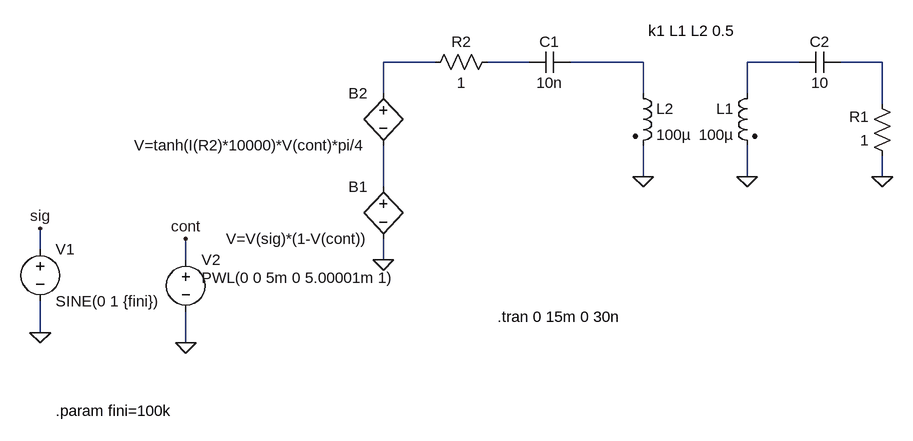
[diagram p0: schematic SS_PTS_v3.asc]
SS_PTS_v3.asc, the LTspice schematic file:
Version 4
SHEET 1 1432 680
WIRE -80 -352 -160 -352
WIRE 64 -352 0 -352
WIRE 240 -352 128 -352
WIRE 480 -352 400 -352
WIRE 608 -352 544 -352
WIRE -160 -304 -160 -352
WIRE 240 -304 240 -352
WIRE 400 -304 400 -352
WIRE 608 -288 608 -352
WIRE 240 -176 240 -224
WIRE 400 -176 400 -224
WIRE 608 -176 608 -208
WIRE -160 -160 -160 -224
WIRE -688 -64 -688 -96
WIRE -464 -48 -464 -80
WIRE -160 -48 -160 -80
WIRE -688 64 -688 16
WIRE -464 80 -464 32
FLAG -688 64 0
FLAG -464 80 0
FLAG -464 -80 cont
FLAG -688 -96 sig
FLAG -160 -48 0
FLAG 400 -176 0
FLAG 608 -176 0
FLAG 240 -176 0
SYMBOL voltage -688 -80 R0
WINDOW 123 0 0 Left 0
WINDOW 39 0 0 Left 0
SYMATTR InstName V1
SYMATTR Value SINE(0 1 {fini})
SYMBOL voltage -464 -64 R0
WINDOW 123 0 0 Left 0
WINDOW 39 0 0 Left 0
WINDOW 3 24 44 Left 2
SYMATTR Value PWL(0 0 5m 0 5.00001m 1)
SYMATTR InstName V2
SYMBOL bv -160 -176 M0
SYMATTR InstName B1
SYMATTR Value V=V(sig)*(1-V(cont))
SYMBOL bv -160 -320 M0
SYMATTR InstName B2
SYMATTR Value V=tanh(I(R2)*10000)*V(cont)*pi/4
SYMBOL ind2 416 -320 M0
SYMATTR InstName L1
SYMATTR Value 100µ
SYMATTR Type ind
SYMBOL cap 128 -368 R90
WINDOW 0 0 32 VBottom 2
WINDOW 3 32 32 VTop 2
SYMATTR InstName C1
SYMATTR Value 10n
SYMBOL res 624 -192 R180
WINDOW 0 36 76 Left 2
WINDOW 3 36 40 Left 2
SYMATTR InstName R1
SYMATTR Value 1
SYMBOL cap 544 -368 R90
WINDOW 0 0 32 VBottom 2
WINDOW 3 32 32 VTop 2
SYMATTR InstName C2
SYMATTR Value 10
SYMBOL res -96 -336 R270
WINDOW 0 32 56 VTop 2
WINDOW 3 0 56 VBottom 2
SYMATTR InstName R2
SYMATTR Value 1
SYMBOL ind2 224 -320 R0
SYMATTR InstName L2
SYMATTR Value 100µ
SYMATTR Type ind
TEXT -664 184 Left 2 !.param fini=100k
TEXT 16 40 Left 2 !.tran 0 15m 0 30n
TEXT 248 -400 Left 2 !k1 L1 L2 0.5

The netlist it stands for:
* SS_PTS_v3.asc
V1 sig 0 SINE(0 1 {fini})
V2 cont 0 PWL(0 0 5m 0 5.00001m 1)
B1 N006 0 V=V(sig)*(1-V(cont))
B2 N001 N006 V=tanh(I(R2)*10000)*V(cont)*pi/4
L1 N004 0 100µ
C1 N003 N002 10n
R1 0 N005 1
C2 N005 N004 10
R2 N001 N002 1
L2 N003 0 100µ
.param fini=100k
.tran 0 15m 0 30n
k1 L1 L2 0.5
.backanno
.end